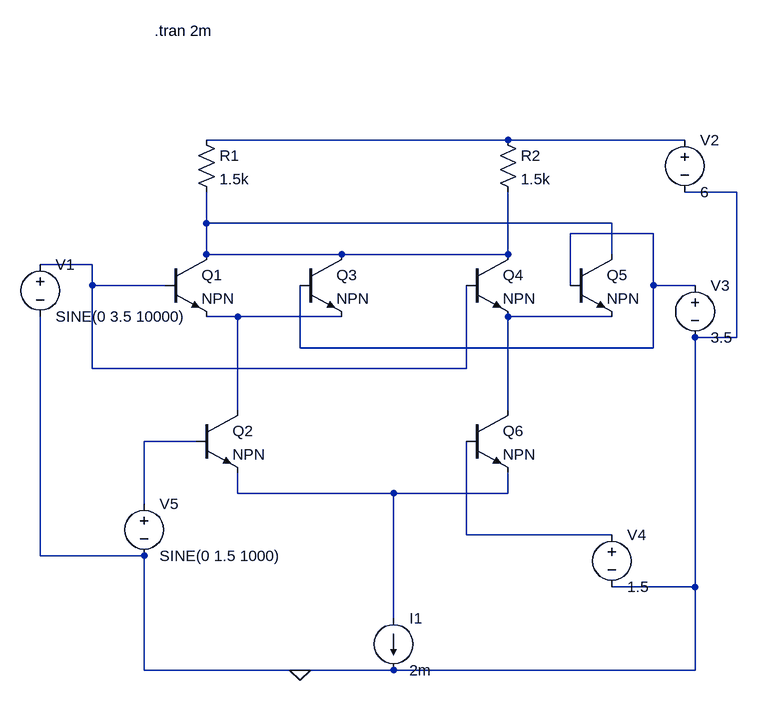
[diagram p0: schematic Draft4.asc]
Draft4.asc, the LTspice schematic file:
Version 4
SHEET 1 1416 896
WIRE 896 64 432 64
WIRE 1168 64 896 64
WIRE 1248 144 1168 144
WIRE 432 192 432 144
WIRE 1056 192 432 192
WIRE 1120 208 992 208
WIRE 432 240 432 192
WIRE 640 240 432 240
WIRE 896 240 896 144
WIRE 896 240 640 240
WIRE 1056 240 1056 192
WIRE 256 256 176 256
WIRE 256 288 256 256
WIRE 368 288 256 288
WIRE 992 288 992 208
WIRE 1120 288 1120 208
WIRE 1184 288 1120 288
WIRE 480 336 432 336
WIRE 640 336 480 336
WIRE 1056 336 896 336
WIRE 1248 368 1248 144
WIRE 1248 368 1184 368
WIRE 576 384 576 288
WIRE 1120 384 1120 288
WIRE 1120 384 576 384
WIRE 256 416 256 288
WIRE 832 416 832 288
WIRE 832 416 256 416
WIRE 480 480 480 336
WIRE 896 480 896 336
WIRE 416 528 336 528
WIRE 480 608 480 576
WIRE 720 608 480 608
WIRE 896 608 896 576
WIRE 896 608 720 608
WIRE 336 624 336 528
WIRE 832 672 832 528
WIRE 1056 672 832 672
WIRE 176 704 176 336
WIRE 336 704 176 704
WIRE 1184 752 1184 368
WIRE 1184 752 1056 752
WIRE 720 800 720 608
WIRE 336 880 336 704
WIRE 576 880 336 880
WIRE 720 880 576 880
WIRE 1184 880 1184 752
WIRE 1184 880 720 880
FLAG 576 880 0
SYMBOL voltage 176 240 R0
SYMATTR InstName V1
SYMATTR Value SINE(0 3.5 10000)
SYMBOL npn 368 240 R0
SYMATTR InstName Q1
SYMBOL npn 416 480 R0
SYMATTR InstName Q2
SYMBOL npn 576 240 R0
SYMATTR InstName Q3
SYMBOL npn 832 240 R0
SYMATTR InstName Q4
SYMBOL npn 992 240 R0
SYMATTR InstName Q5
SYMBOL npn 832 480 R0
SYMATTR InstName Q6
SYMBOL res 416 48 R0
SYMATTR InstName R1
SYMATTR Value 1.5k
SYMBOL res 880 48 R0
SYMATTR InstName R2
SYMATTR Value 1.5k
SYMBOL voltage 1168 48 R0
SYMATTR InstName V2
SYMATTR Value 6
SYMBOL voltage 1184 272 R0
SYMATTR InstName V3
SYMATTR Value 3.5
SYMBOL voltage 1056 656 R0
SYMATTR InstName V4
SYMATTR Value 1.5
SYMBOL voltage 336 608 R0
SYMATTR InstName V5
SYMATTR Value SINE(0 1.5 1000)
SYMBOL current 720 800 R0
SYMATTR InstName I1
SYMATTR Value 2m
TEXT 352 -104 Left 2 !.tran 2m

The netlist it stands for:
* Draft4.asc
V1 N004 0 SINE(0 3.5 10000)
Q1 N002 N004 N005 0 NPN
Q2 N005 N007 N008 0 NPN
Q3 N002 N003 N005 0 NPN
Q4 N002 N004 N006 0 NPN
Q5 N002 N003 N006 0 NPN
Q6 N006 N009 N008 0 NPN
R1 N001 N002 1.5k
R2 N001 N002 1.5k
V2 N001 0 6
V3 N003 0 3.5
V4 N009 0 1.5
V5 N007 0 SINE(0 1.5 1000)
I1 N008 0 2m
.model NPN NPN
.model PNP PNP
.lib standard.bjt
.tran 2m
.backanno
.end